# EasyEDA schematic SCH_StorageGuard.json
TITLE: Storage Guard; REV: 1.0; Date: 2023-07-20; Sheet: 1/1; Company: Storage Guard
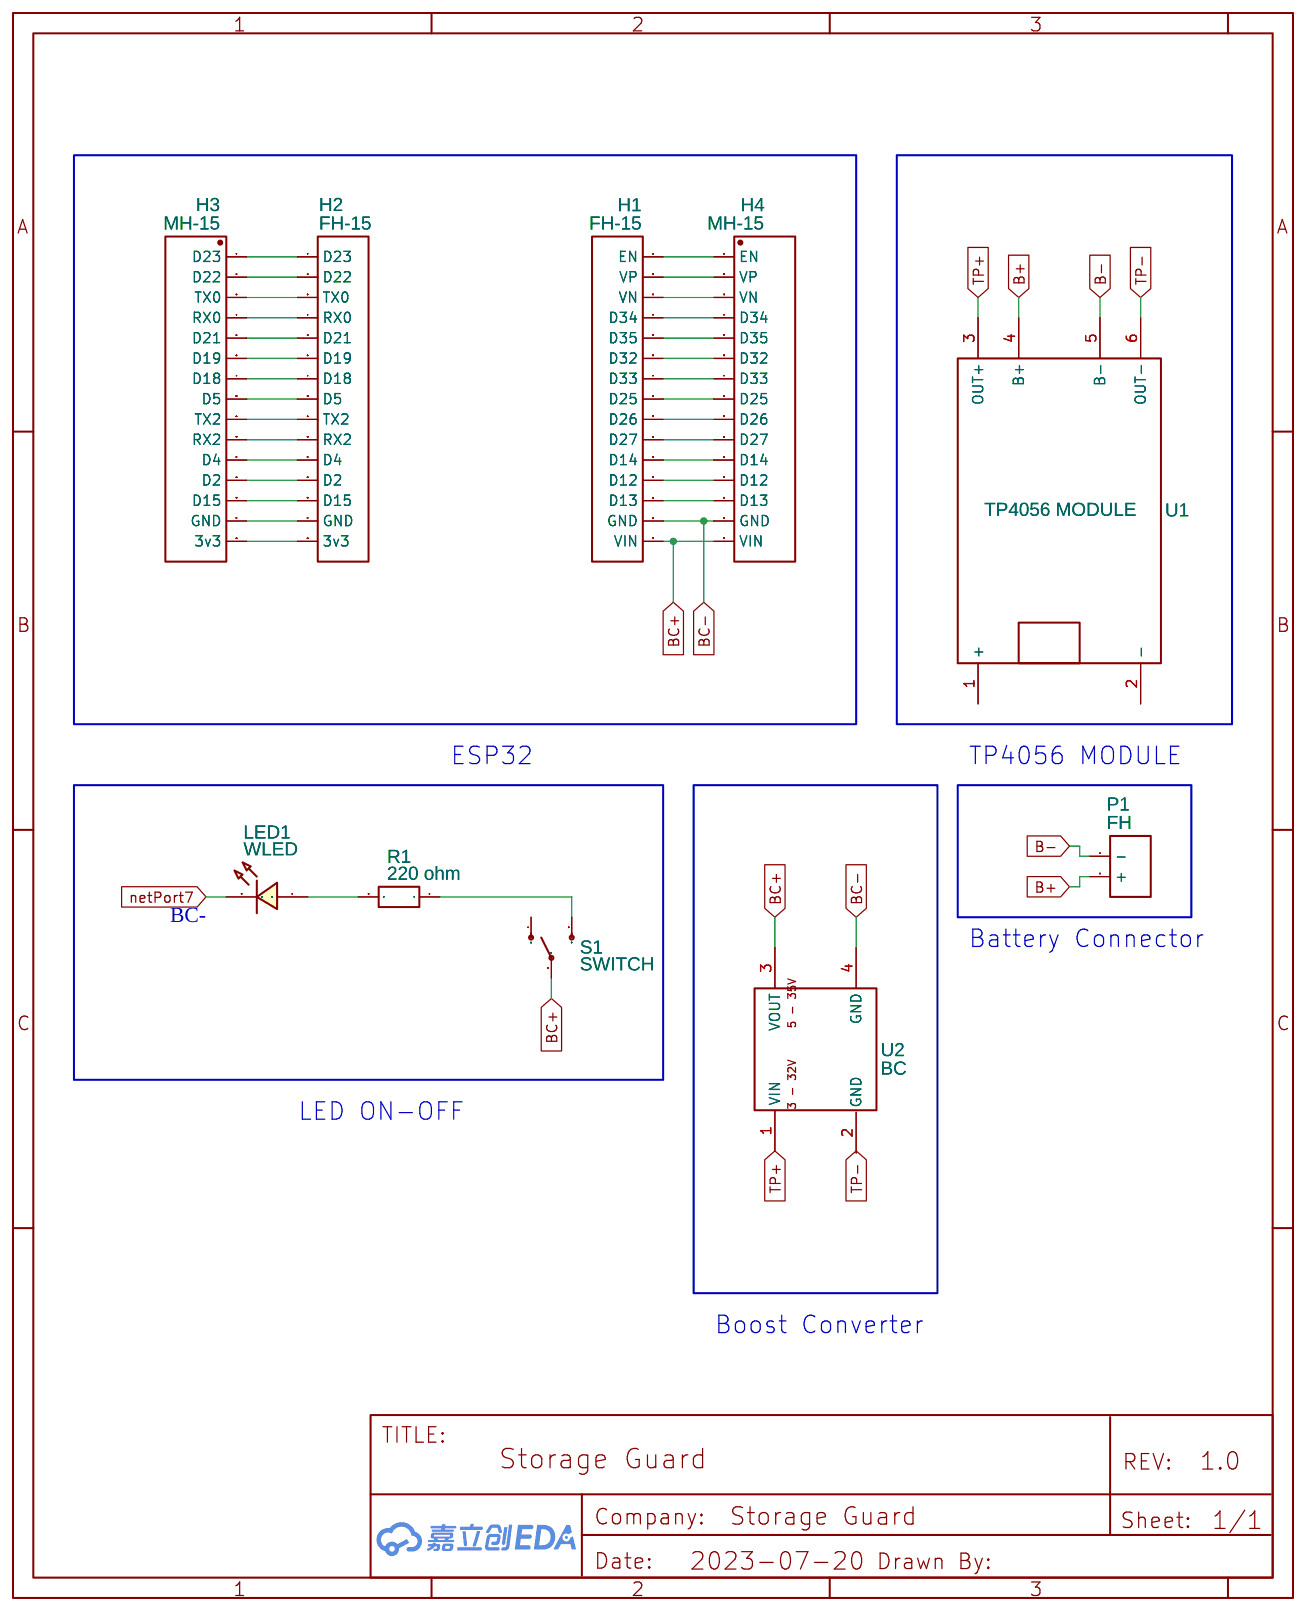
[diagram p0: schematic sheet]

## Parts
H1  FH-15  [HDR-TH_15P-P2.54-V-F-1]
H2  FH-15  [HDR-TH_15P-P2.54-V-F-1]
H3  MH-15  [HDR-TH_15P-P2.54-V-M]
H4  MH-15  [HDR-TH_15P-P2.54-V-M]
LED1  WLED  [LED-TH_BD5.0_BLUE]
P1  FH  [HDR-TH_2P-P2.54-V-F]
R1  220 ohm  [RES-TH_12R_2W]
S1  SWITCH  [SWITCH-SPDT-8.5MM]
U1  TP4056 MODULE  [TP4056 MODULE LITHIUM BATTERY CHARGING MODULE]
U2  BC  [STEP UP XL6009E1]

## Library data of the parts
H1 H2 = Header-Female-2.54_1x15: Supplier: LCSC; Manufacturer: Ckmtw(灿科盟); Manufacturer Part: B-2200S15P-A120; Supplier Part: C124408; JLCPCB Part Class: Extended Part
H3 H4 = Header-Male-2.54_1x15: Supplier: LCSC; Manufacturer: Ckmtw(灿科盟); Manufacturer Part: B-2100S15P-A110; Contributor: LCSC; Supplier Part: C124373; JLCPCB Part Class: Extended Part
LED1 = LED-TH-5mm_B: Supplier: LCSC; Contributor: kurekciyusuf
P1 = Header-Female-2.54_1x2: Supplier: LCSC; Manufacturer: BOOMELE(博穆精密); Manufacturer Part: 2.54-1*2P母; Supplier Part: C49661; JLCPCB Part Class: Extended Part
R1 = RESISTOR_THT:R_AXIAL_DIN0309_L9.0MM_D3.2MM_P2.54MM_VERTICAL: Supplier: LCSC; Supplier Part: C9900016274; Manufacturer: null; Manufacturer Part: Resistor_THT:R_Axial_DIN0309_L9.0mm_D3.2mm_P2.54mm_Vertical; JLCPCB Part Class: Extended Part; Contributor: lcsc
S1 = SWITCH-SPDT-8.5mm: Contributor: SparkFun
U1 = TP4056 MODULE: Contributor: Circuit Master
U2 = STEP-UP XL6009E1: Contributor: guillaume888; Package Display: No

## Nets
B+: P1.2(+) U1.4(B+)
B-: P1.1(-) U1.5(B-)
BC+: H1.15(VIN) H4.15(VIN) S1.2(P) U2.3(VOUT)
BC-: H1.14(GND) H4.14(GND) U2.4(GND)
netPort7: LED1.2
TP+: U1.3(OUT+) U2.1(VIN)
TP-: U1.6(OUT-) U2.2(GND)
Net-(H1-1): H1.1(EN) H4.1(EN)
Net-(H1-2): H1.2(VP) H4.2(VP)
Net-(H1-3): H1.3(VN) H4.3(VN)
Net-(H1-4): H1.4(D34) H4.4(D34)
Net-(H1-5): H1.5(D35) H4.5(D35)
Net-(H1-6): H1.6(D32) H4.6(D32)
Net-(H1-7): H1.7(D33) H4.7(D33)
Net-(H1-8): H1.8(D25) H4.8(D25)
Net-(H1-9): H1.9(D26) H4.9(D26)
Net-(H1-10): H1.10(D27) H4.10(D27)
Net-(H1-11): H1.11(D14) H4.11(D14)
Net-(H1-12): H1.12(D12) H4.12(D12)
Net-(H1-13): H1.13(D13) H4.13(D13)
Net-(H2-1): H2.1(D23) H3.1(D23)
Net-(H2-2): H2.2(D22) H3.2(D22)
Net-(H2-3): H2.3(TX0) H3.3(TX0)
Net-(H2-4): H2.4(RX0) H3.4(RX0)
Net-(H2-5): H2.5(D21) H3.5(D21)
Net-(H2-6): H2.6(D19) H3.6(D19)
Net-(H2-7): H2.7(D18) H3.7(D18)
Net-(H2-8): H2.8(D5) H3.8(D5)
Net-(H2-9): H2.9(TX2) H3.9(TX2)
Net-(H2-10): H2.10(RX2) H3.10(RX2)
Net-(H2-11): H2.11(D4) H3.11(D4)
Net-(H2-12): H2.12(D2) H3.12(D2)
Net-(H2-13): H2.13(D15) H3.13(D15)
Net-(H2-14): H2.14(GND) H3.14(GND)
Net-(H2-15): H2.15(3v3) H3.15(3v3)
Net-(LED1-1): LED1.1 R1.2
Net-(R1-1): R1.1 S1.3(S)

Not connected (* = marked no-connect by the designer): S1 1(O); U1 1(+) 2(-)

## Notes on the sheet
- ESP32
- TP4056 MODULE
- BC-
- Battery Connector
- LED ON-OFF
- Boost Converter
